# EAGLE design Bus Controller (EAGLE 5.06)
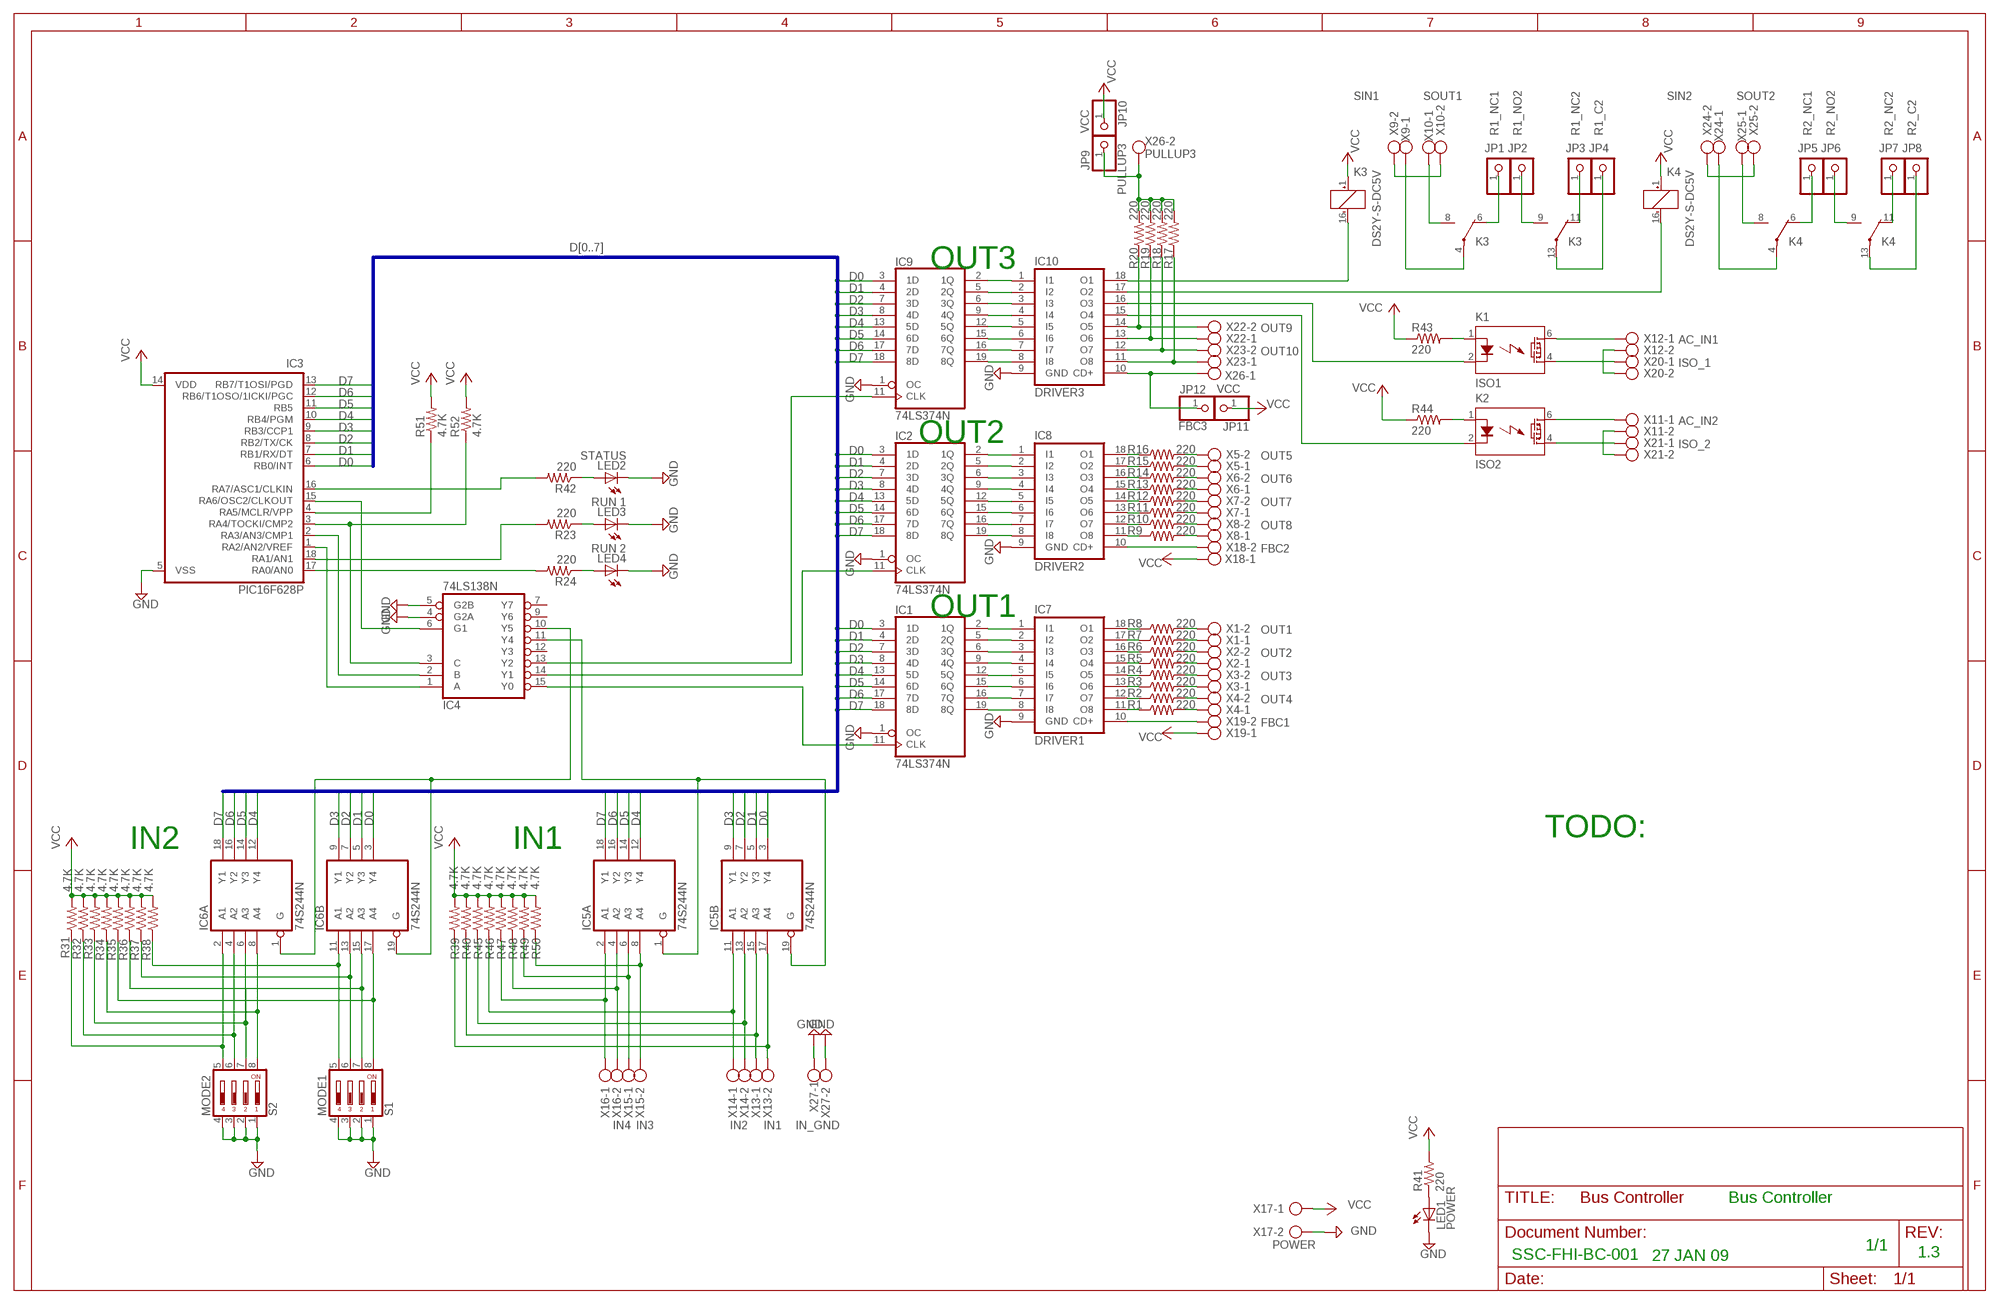
[diagram p0: schematic, sheet 1]

## Parts
IC1  74LS374N  [DIL20]
IC2  74LS374N  [DIL20]
IC3  PIC16F628P  [DIL18]
IC4  74LS138N  [DIL16]
IC5  74S244N  [DIL20]
IC6  74S244N  [DIL20]
IC7  DRIVER1  ULN2803A  [DIL18]
IC8  DRIVER2  ULN2803A  [DIL18]
IC9  74LS374N  [DIL20]
IC10  DRIVER3  ULN2803A  [DIL18]
JP1  R1_NC1  PINHD-1X1  [1X01]
JP2  R1_NO2  PINHD-1X1  [1X01]
JP3  R1_NC2  PINHD-1X1  [1X01]
JP4  R1_C2  PINHD-1X1  [1X01]
JP5  R2_NC1  PINHD-1X1  [1X01]
JP6  R2_NO2  PINHD-1X1  [1X01]
JP7  R2_NC2  PINHD-1X1  [1X01]
JP8  R2_C2  PINHD-1X1  [1X01]
JP9  PULLUP3  PINHD-1X1  [1X01]
JP10  VCC  PINHD-1X1  [1X01]
JP11  VCC  PINHD-1X1  [1X01]
JP12  FBC3  PINHD-1X1  [1X01]
K1  ISO1  LCA110  [DIL06]
K2  ISO2  LCA110  [DIL06]
K3  DS2Y-S-DC5V  [DS2Y]
K4  DS2Y-S-DC5V  [DS2Y]
LED1  POWER  LED5MM  [LED5MM]
LED2  STATUS  LED5MM  [LED5MM]
LED3  RUN 1  LED5MM  [LED5MM]
LED4  RUN 2  LED5MM  [LED5MM]
R1  220  R-US_0207/2V  [0207/2V]
R2  220  R-US_0207/2V  [0207/2V]
R3  220  R-US_0207/2V  [0207/2V]
R4  220  R-US_0207/2V  [0207/2V]
R5  220  R-US_0207/2V  [0207/2V]
R6  220  R-US_0207/2V  [0207/2V]
R7  220  R-US_0207/2V  [0207/2V]
R8  220  R-US_0207/2V  [0207/2V]
R9  220  R-US_0207/2V  [0207/2V]
R10  220  R-US_0207/2V  [0207/2V]
R11  220  R-US_0207/2V  [0207/2V]
R12  220  R-US_0207/2V  [0207/2V]
R13  220  R-US_0207/2V  [0207/2V]
R14  220  R-US_0207/2V  [0207/2V]
R15  220  R-US_0207/2V  [0207/2V]
R16  220  R-US_0207/2V  [0207/2V]
R17  220  R-US_0207/2V  [0207/2V]
R18  220  R-US_0207/2V  [0207/2V]
R19  220  R-US_0207/2V  [0207/2V]
R20  220  R-US_0207/2V  [0207/2V]
R23  220  R-US_0207/2V  [0207/2V]
R24  220  R-US_0207/2V  [0207/2V]
R31  4.7K  R-US_0207/2V  [0207/2V]
R32  4.7K  R-US_0207/2V  [0207/2V]
R33  4.7K  R-US_0207/2V  [0207/2V]
R34  4.7K  R-US_0207/2V  [0207/2V]
R35  4.7K  R-US_0207/2V  [0207/2V]
R36  4.7K  R-US_0207/2V  [0207/2V]
R37  4.7K  R-US_0207/2V  [0207/2V]
R38  4.7K  R-US_0207/2V  [0207/2V]
R39  4.7K  R-US_0207/2V  [0207/2V]
R40  4.7K  R-US_0207/2V  [0207/2V]
R41  220  R-US_0207/2V  [0207/2V]
R42  220  R-US_0207/2V  [0207/2V]
R43  220  R-US_0207/2V  [0207/2V]
R44  220  R-US_0207/2V  [0207/2V]
R45  4.7K  R-US_0207/2V  [0207/2V]
R46  4.7K  R-US_0207/2V  [0207/2V]
R47  4.7K  R-US_0207/2V  [0207/2V]
R48  4.7K  R-US_0207/2V  [0207/2V]
R49  4.7K  R-US_0207/2V  [0207/2V]
R50  4.7K  R-US_0207/2V  [0207/2V]
R51  4.7K  R-US_0207/2V  [0207/2V]
R52  4.7K  R-US_0207/2V  [0207/2V]
S1  MODE1  DS04  [DS-04]
S2  MODE2  DS04  [DS-04]
X1  OUT1  AK550/2  [AK550/2]
X2  OUT2  AK550/2  [AK550/2]
X3  OUT3  AK550/2  [AK550/2]
X4  OUT4  AK550/2  [AK550/2]
X5  OUT5  AK550/2  [AK550/2]
X6  OUT6  AK550/2  [AK550/2]
X7  OUT7  AK550/2  [AK550/2]
X8  OUT8  AK550/2  [AK550/2]
X9  SIN1  AK550/2  [AK550/2]
X10  SOUT1  AK550/2  [AK550/2]
X11  AC_IN2  AK550/2  [AK550/2]
X12  AC_IN1  AK550/2  [AK550/2]
X13  IN1  AK550/2  [AK550/2]
X14  IN2  AK550/2  [AK550/2]
X15  IN3  AK550/2  [AK550/2]
X16  IN4  AK550/2  [AK550/2]
X17  POWER  AK500/2  [AK500/2]
X18  FBC2  AK550/2  [AK550/2]
X19  FBC1  AK550/2  [AK550/2]
X20  ISO_1  AK550/2  [AK550/2]
X21  ISO_2  AK550/2  [AK550/2]
X22  OUT9  AK550/2  [AK550/2]
X23  OUT10  AK550/2  [AK550/2]
X24  SIN2  AK550/2  [AK550/2]
X25  SOUT2  AK550/2  [AK550/2]
X26  PULLUP3  AK550/2  [AK550/2]
X27  IN_GND  AK550/2  [AK550/2]

## Nets
A0: IC3.1(RA2/AN2/VREF) IC4.1(A)
A1: IC3.2(RA3/AN3/CMP1) IC4.2(B)
A2: IC3.3(RA4/TOCKI/CMP2) IC4.3(C) R52.1
ADDR_EN: IC3.15(RA6/OSC2/CLKOUT) IC4.6(G1)
D0: IC1.3(1D) IC2.3(1D) IC3.6(RB0/INT) IC5.3(B:Y4) IC6.3(B:Y4) IC9.3(1D)
D1: IC1.4(2D) IC2.4(2D) IC3.7(RB1/RX/DT) IC5.5(B:Y3) IC6.5(B:Y3) IC9.4(2D)
D2: IC1.7(3D) IC2.7(3D) IC3.8(RB2/TX/CK) IC5.7(B:Y2) IC6.7(B:Y2) IC9.7(3D)
D3: IC1.8(4D) IC2.8(4D) IC3.9(RB3/CCP1) IC5.9(B:Y1) IC6.9(B:Y1) IC9.8(4D)
D4: IC1.13(5D) IC2.13(5D) IC3.10(RB4/PGM) IC5.12(A:Y4) IC6.12(A:Y4) IC9.13(5D)
D5: IC1.14(6D) IC2.14(6D) IC3.11(RB5) IC5.14(A:Y3) IC6.14(A:Y3) IC9.14(6D)
D6: IC1.17(7D) IC2.17(7D) IC3.12(RB6/T1OSO/1ICKI/PGC) IC5.16(A:Y2) IC6.16(A:Y2) IC9.17(7D)
D7: IC1.18(8D) IC2.18(8D) IC3.13(RB7/T1OSI/PGD) IC5.18(A:Y1) IC6.18(A:Y1) IC9.18(8D)
FBC1: IC7.10(CD+) X19.2
FBC2: IC8.10(CD+) X18.2
FBC3: IC10.10(CD+) JP12.1 X26.1
GND: IC1.1(OC) IC2.1(OC) IC3.5(VSS) IC4.4(G2A) IC4.5(G2B) IC7.9(GND) IC8.9(GND) IC9.1(OC) IC10.9(GND) LED1.K(C) LED2.K(C) LED3.K(C) LED4.K(C) S1.1 S1.2 S1.3 S1.4 S2.1 S2.2 S2.3 S2.4 X17.2 X27.1 X27.2
IN1: IC5.17(B:A4) R39.1 X13.2
IN2: IC5.15(B:A3) R40.1 X13.1
IN3: IC5.13(B:A2) R45.1 X14.2
IN4: IC5.11(B:A1) R46.1 X14.1
IN5: IC5.8(A:A4) R50.1 X15.2
IN6: IC5.6(A:A3) R49.1 X15.1
IN7: IC5.4(A:A2) R48.1 X16.2
IN8: IC5.2(A:A1) R47.1 X16.1
IN9: IC6.17(B:A4) R35.1 S1.8
IN10: IC6.15(B:A3) R36.1 S1.7
IN11: IC6.13(B:A2) R37.1 S1.6
IN12: IC6.11(B:A1) R38.1 S1.5
IN13: IC6.8(A:A4) R34.1 S2.8
IN14: IC6.6(A:A3) R33.1 S2.7
IN15: IC6.4(A:A2) R32.1 S2.6
IN16: IC6.2(A:A1) R31.1 S2.5
ISO_IN1: K1.6(D1) X12.1
ISO_IN2: K2.6(D1) X11.1
ISO_OUT1: K1.4(D2) X20.1
ISO_OUT2: K2.4(D2) X21.1
ISOGND1: X12.2 X20.2
ISOGND2: X11.2 X21.2
N$2: IC3.4(RA5/MCLR/VPP) R51.1
N$3: IC4.13(Y2) IC9.11(CLK)
N$4: IC7.12(O7) R2.1
N$5: IC2.11(CLK) IC4.14(Y1)
N$6: IC1.11(CLK) IC4.15(Y0)
N$7: IC9.19(8Q) IC10.8(I8)
N$8: IC9.16(7Q) IC10.7(I7)
N$9: IC9.15(6Q) IC10.6(I6)
N$10: IC9.12(5Q) IC10.5(I5)
N$11: IC9.9(4Q) IC10.4(I4)
N$12: IC7.18(O1) R8.1
N$13: IC7.17(O2) R7.1
N$14: IC7.16(O3) R6.1
N$15: IC7.15(O4) R5.1
N$16: IC9.6(3Q) IC10.3(I3)
N$17: IC8.12(O7) R10.1
N$18: IC9.5(2Q) IC10.2(I2)
N$19: IC9.2(1Q) IC10.1(I1)
N$20: IC1.16(7Q) IC7.7(I7)
N$21: IC7.14(O5) R4.1
N$22: IC1.19(8Q) IC7.8(I8)
N$23: IC1.2(1Q) IC7.1(I1)
N$24: IC1.5(2Q) IC7.2(I2)
N$25: IC1.6(3Q) IC7.3(I3)
N$26: IC1.9(4Q) IC7.4(I4)
N$27: IC1.12(5Q) IC7.5(I5)
N$28: IC1.15(6Q) IC7.6(I6)
N$29: IC2.19(8Q) IC8.8(I8)
N$30: IC7.13(O6) R3.1
N$31: IC2.16(7Q) IC8.7(I7)
N$32: IC7.11(O8) R1.1
N$33: IC2.15(6Q) IC8.6(I6)
N$34: IC10.16(O3) K1.2(K)
N$35: IC10.15(O4) K2.2(K)
N$37: LED4.A R24.1
N$38: LED3.A R23.1
N$40: IC10.14(O5) R20.1 X22.2
N$41: IC10.13(O6) R19.1 X22.1
N$42: IC10.12(O7) R18.1 X23.2
N$43: IC10.11(O8) R17.1 X23.1
N$55: IC2.2(1Q) IC8.1(I1)
N$56: IC2.5(2Q) IC8.2(I2)
N$57: IC2.6(3Q) IC8.3(I3)
N$58: IC2.9(4Q) IC8.4(I4)
N$59: IC2.12(5Q) IC8.5(I5)
N$61: IC8.18(O1) R16.1
N$62: IC8.17(O2) R15.1
N$63: IC8.16(O3) R14.1
N$64: IC8.15(O4) R13.1
N$65: IC8.14(O5) R12.1
N$66: IC8.13(O6) R11.1
N$68: IC8.11(O8) R9.1
N$71: LED1.A R41.1
N$105: IC4.10(Y5) IC6.1(A:G) IC6.19(B:G)
N$106: LED2.A R42.1
N$107: K1.1(A) R43.2
N$108: K2.1(A) R44.2
N$109: IC4.11(Y4) IC5.1(A:G) IC5.19(B:G)
OUT1: R8.2 X1.2
OUT2: R7.2 X1.1
OUT3: R6.2 X2.2
OUT4: R5.2 X2.1
OUT5: R4.2 X3.2
OUT6: R3.2 X3.1
OUT7: R2.2 X4.2
OUT8: R1.2 X4.1
OUT9: R16.2 X5.2
OUT10: R15.2 X5.1
OUT11: R14.2 X6.2
OUT12: R13.2 X6.1
OUT13: R12.2 X7.2
OUT14: R11.2 X7.1
OUT15: R10.2 X8.2
OUT16: R9.2 X8.1
OUT17: IC10.18(O1) K3.16(1:-)
OUT18: IC10.17(O2) K4.16(1:-)
PULLUP3: JP9.1 R17.2 R18.2 R19.2 R20.2 X26.2
R1_C1: K3.4(2:P) X9.1
R1_C2: JP4.1 K3.13(3:P)
R1_GND: X9.2 X10.2
R1_NC1: JP1.1 K3.6(2:O)
R1_NC2: JP3.1 K3.11(3:O)
R1_NO1: K3.8(2:S) X10.1
R1_NO2: JP2.1 K3.9(3:S)
R2_C1: K4.4(2:P) X24.1
R2_C2: JP8.1 K4.13(3:P)
R2_GND: X24.2 X25.2
R2_NC1: JP5.1 K4.6(2:O)
R2_NC2: JP7.1 K4.11(3:O)
R2_NO1: K4.8(2:S) X25.1
R2_NO2: JP6.1 K4.9(3:S)
RUN1: IC3.18(RA1/AN1) R23.2
RUN2: IC3.17(RA0/AN0) R24.2
STATUS: IC3.16(RA7/ASC1/CLKIN) R42.2
VCC: IC3.14(VDD) JP10.1 JP11.1 K3.1(1:+) K4.1(1:+) R31.2 R32.2 R33.2 R34.2 R35.2 R36.2 R37.2 R38.2 R39.2 R40.2 R41.2 R43.1 R44.1 R45.2 R46.2 R47.2 R48.2 R49.2 R50.2 R51.2 R52.2 X17.1 X18.1 X19.1
Unconnected: IC4.7(Y7) IC4.9(Y6) IC4.12(Y3)

## Buses
D[0..7]

## Notes on the sheet
- OUT3
- OUT2
- OUT1
- TODO:
- IN2 | IN1
- Bus Controller
- 1/1
- SSC-FHI-BC-001 | 27 JAN 09 | 1.3

## Power pins joined to a net without a drawn wire
GND: IC1.10(GND) IC2.10(GND) IC4.8(GND) IC5.10(P:GND) IC6.10(P:GND) IC9.10(GND)
VCC: IC1.20(VCC) IC2.20(VCC) IC4.16(VCC) IC5.20(P:VCC) IC6.20(P:VCC) IC9.20(VCC)

## Library data of the parts
IC1 IC2 IC9 = 74xx-us:74*374: Octal D type transparent LATCH, edge triggered
IC3 = microchip:PIC16*F62: FLASH-Based 8-Bit CMOS Microcontroller Source: http://ww1.microchip.com/downloads/en/DeviceDoc/40300C.pdf
IC4 = 74xx-eu:74*138: 3-line to 8-line DECODER/DEMULTIPLEXER
IC5 IC6 = 74xx-us:74*244: Octal BUFFER and LINE DRIVER, 3-state
IC7 IC8 IC10 = uln-udn:ULN2803A: DRIVER ARRAY
JP1-JP12 = pinhead:PINHD-1X1: PIN HEADER
K1 K2 = relay:LCA110: Solid state relay. Clare LCA110
K3 K4 = relay:DS2Y-S-DC*: MINIATURE RELAY NAiS Source: http://www.mew-europe.com/.. en_ds_61005_0023.pdf
LED1-LED4 = led:LED: LED OSRAM: - CHIPLED LG R971, LG N971, LY N971, LG Q971, LY Q971, LO R971, LY R971 LH N974, LH R974 LS Q976, LO Q976, LY Q976 LO Q996 - Hyper CHIPLED LW Q18S LB Q993, LB Q99A, LB R99A - SideLED LS A670, LO A670, LY A670, LG A670, LP A670 LB A673, LV A673, LT A673, LW A673 LH A674 LY A675 LS A676, LA A676, LO A676, LY A676, LW A676 LS A679, LY A679, LG A679 - Hyper Micro SIDELED® LS Y876, LA Y876, LO Y876, LY Y876 LT Y87S - SmartLED LW L88C, LW L88S LB L89C, LB L89S, LG L890 LS L89K, LO L89K, LY L89K LS L896, LA L896, LO L896, LY L896 - TOPLED LS T670, LO T670, LY T670, LG T670, LP T670 LSG T670, LSP T670, LSY T670, LOP T670, LYG T670 LG T671, LOG T671, LSG T671 LB T673, LV T673, LT T673, LW T673 LH T674 LS T676, LA T676, LO T676, LY T676, LB T676, LH T676, LSB T676, LW T676 LB T67C, LV T67C, LT T67C, LS T67K, LO T67K, LY T67K, LW E67C LS E67B, LA E67B, LO E67B, LY E67B, LB E67C, LV E67C, LT E67C LW T67C LS T679, LY T679, LG T679 LS T770, LO T770, LY T770, LG T770, LP T770 LB T773, LV T773, LT T773, LW T773 LH T774 LS E675, LA E675, LY E675, LS T675 LS T776, LA T776, LO T776, LY T776, LB T776 LHGB T686 LT T68C, LB T68C - Hyper Mini TOPLED® LB M676 - Mini TOPLED Santana® LG M470 LS M47K, LO M47K, LY M47K Source: http://www.osram.convergy.de - LUMILED® LXK2-PW12-R00, LXK2-PW12-S00, LXK2-PW14-U00, LXK2-PW14-V00 LXK2-PM12-R00, LXK2-PM12-S00, LXK2-PM14-U00 LXK2-PE12-Q00, LXK2-PE12-R00, LXK2-PE12-S00, LXK2-PE14-T00, LXK2-PE14-U00 LXK2-PB12-K00, LXK2-PB12-L00, LXK2-PB12-M00, LXK2-PB14-N00, LXK2-PB14-P00, LXK2-PB14-Q00 LXK2-PR12-L00, LXK2-PR12-M00, LXK2-PR14-Q00, LXK2-PR14-R00 LXK2-PD12-Q00, LXK2-PD12-R00, LXK2-PD12-S00 LXK2-PH12-R00, LXK2-PH12-S00 LXK2-PL12-P00, LXK2-PL12-Q00, LXK2-PL12-R00 Source: www.luxeon.com
R1-R20 R23 R24 R31-R52 = resistor:R-US_: RESISTOR, American symbol
S1 S2 = switch-dil:DS04: DIL/CODE SWITCH
X1-X16 X18-X27 = con-ptr500+_v5:AK550/2: CONNECTOR
X17 = con-ptr500:AK500/2: CONNECTOR

## Board
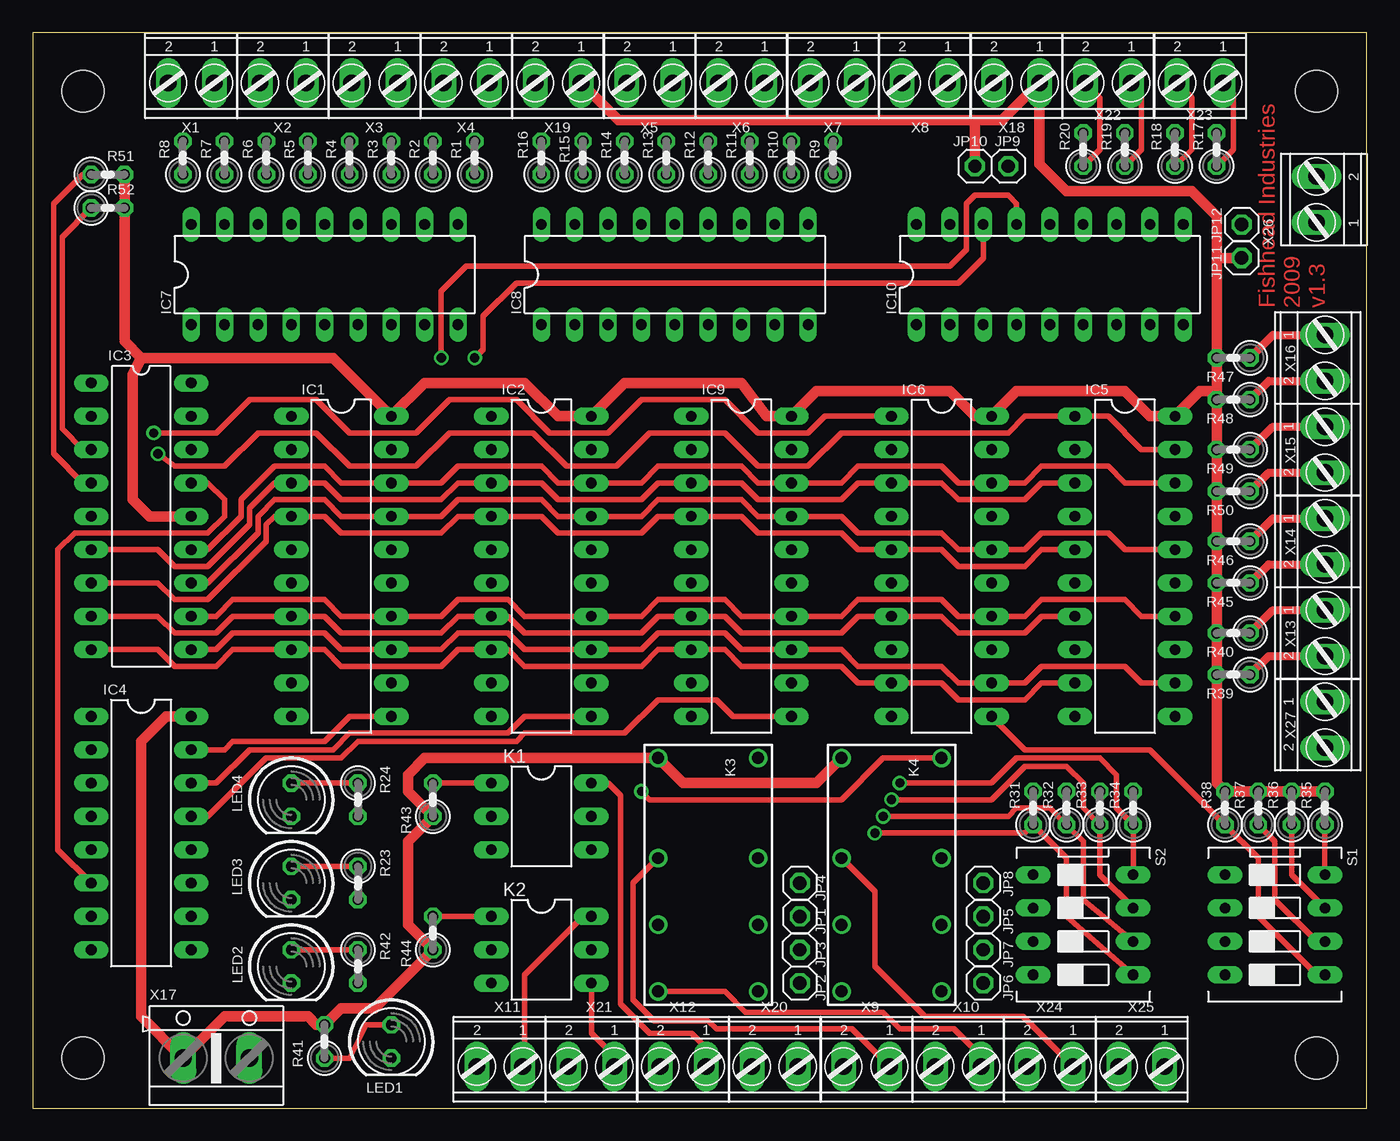
[diagram p1: board, top side]
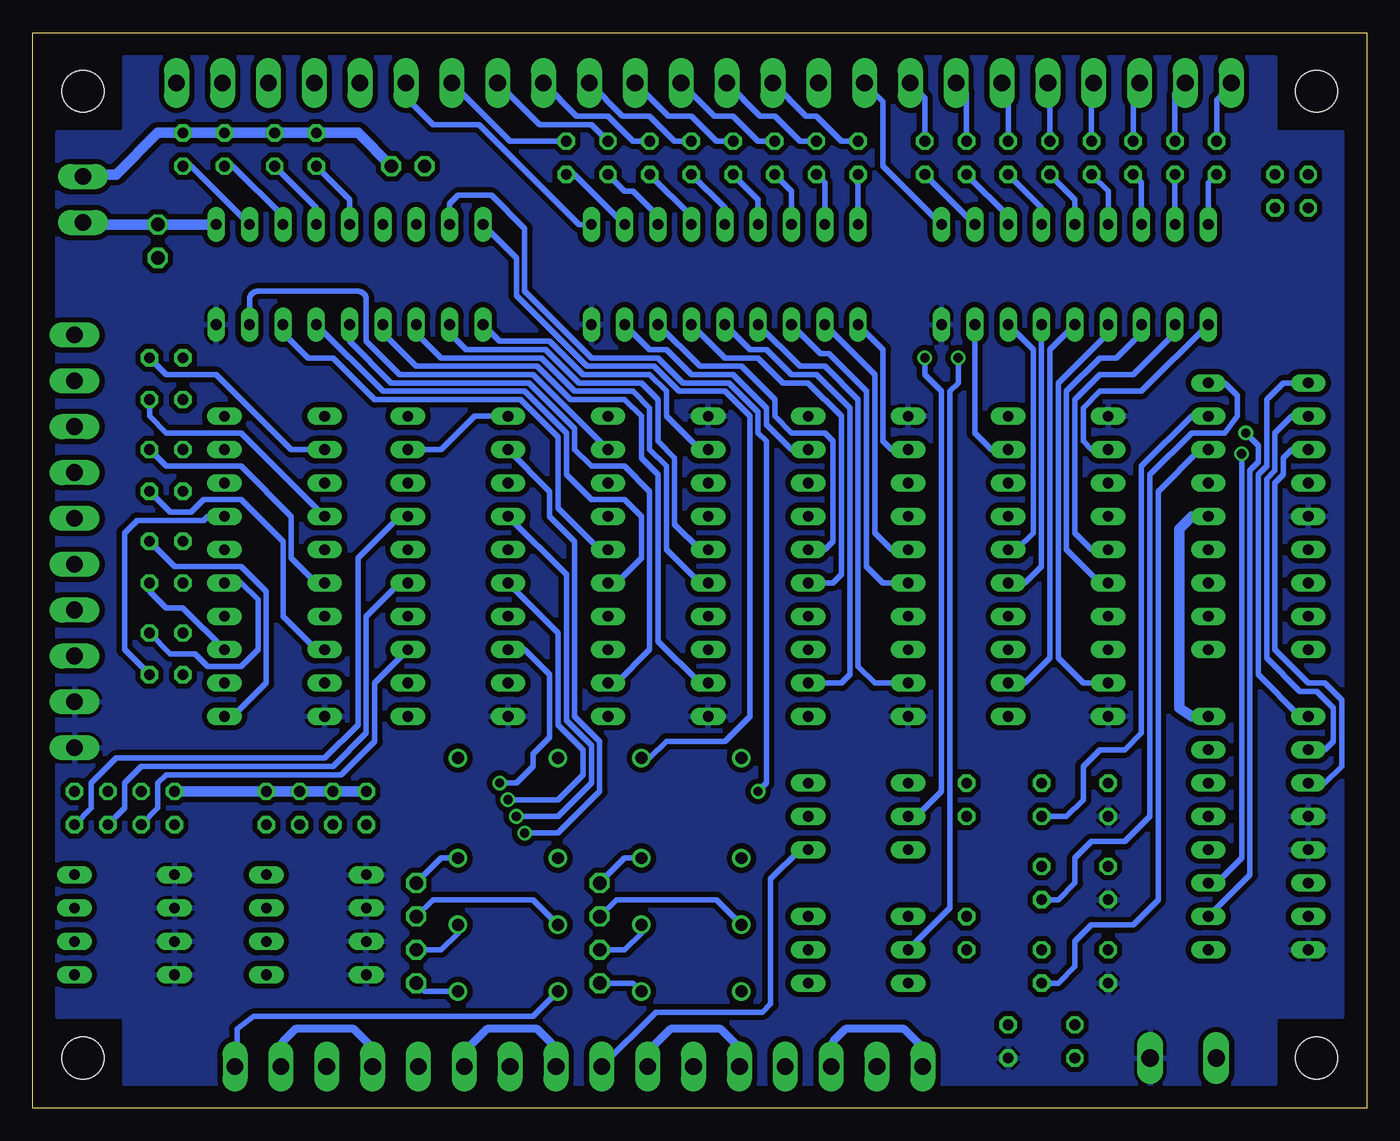
[diagram p2: board, bottom side, seen from below]

Size 101.6 x 81.92 mm. Coordinates in mm from the lower left corner, seen from the top.
Outline: 0,0 101.6,0 101.6,81.92 0,81.92 0,0
Copper layers (1*16): Top 0.035mm / dielectric 1.5mm / Bottom 0.035mm
Design rules "default *": minimum track width 10mil, minimum drill 24mil, track to track 16mil, track to pad 16mil, pad to pad 16mil, via to via 8mil, smd to smd 8mil, copper to edge 40mil, drill to drill 8mil, minimum pad ring 10mil, minimum via ring 8mil, stop-mask expansion 4mil, vias tented up to drill 0mil, thermal gap 10mil
Holes 3.2 mm at 3.81,3.81 97.79,3.81 97.79,77.47 3.81,77.47

### Footprints (pad centres in the part's own frame; a part is rotated, then mirrored left to right if it is on the bottom)
DIL20 = drill 0.813 long: 1 -11.43,-3.81; 2 -8.89,-3.81; 3 -6.35,-3.81; 4 -3.81,-3.81; 5 -1.27,-3.81; 6 1.27,-3.81; 7 3.81,-3.81; 8 6.35,-3.81; 9 8.89,-3.81; 10 11.43,-3.81; 11 11.43,3.81; 12 8.89,3.81; 13 6.35,3.81; 14 3.81,3.81; 15 1.27,3.81; 16 -1.27,3.81; 17 -3.81,3.81; 18 -6.35,3.81; 19 -8.89,3.81; 20 -11.43,3.81
DIL18 = drill 0.813 long: 1 -10.16,-3.81; 2 -7.62,-3.81; 3 -5.08,-3.81; 4 -2.54,-3.81; 5 0,-3.81; 6 2.54,-3.81; 7 5.08,-3.81; 8 7.62,-3.81; 9 10.16,-3.81; 10 10.16,3.81; 11 7.62,3.81; 12 5.08,3.81; 13 2.54,3.81; 14 0,3.81; 15 -2.54,3.81; 16 -5.08,3.81; 17 -7.62,3.81; 18 -10.16,3.81
DIL16 = drill 0.813 long: 1 -8.89,-3.81; 2 -6.35,-3.81; 3 -3.81,-3.81; 4 -1.27,-3.81; 5 1.27,-3.81; 6 3.81,-3.81; 7 6.35,-3.81; 8 8.89,-3.81; 9 8.89,3.81; 10 6.35,3.81; 11 3.81,3.81; 12 1.27,3.81; 13 -1.27,3.81; 14 -3.81,3.81; 15 -6.35,3.81; 16 -8.89,3.81
1X01 = drill 1.016 octagon: 1 0,0
DIL06 = drill 0.813 long: 1 -2.54,-3.81; 2 0,-3.81; 3 2.54,-3.81; 4 2.54,3.81; 5 0,3.81; 6 -2.54,3.81
DS2Y = drill 0.9 round: 1 -8.89,-3.81; 4 -1.27,-3.81; 6 3.81,-3.81; 8 8.89,-3.81; 9 8.89,3.81; 11 3.81,3.81; 13 -1.27,3.81; 16 -8.89,3.81
LED5MM = drill 0.813 octagon: A -1.27,0; K 1.27,0
0207/2V = drill 0.813 octagon: 1 -1.27,0; 2 1.27,0
DS-04 = drill 0.813 long: 1 -3.81,-3.81; 2 -1.27,-3.81; 3 1.27,-3.81; 4 3.81,-3.81; 5 3.81,3.81; 6 1.27,3.81; 7 -1.27,3.81; 8 -3.81,3.81
AK550/2 = drill 1.27 long: 1 -1.75,0; 2 1.75,0
AK500/2 = drill 1.321 long: 1 -2.515,0; 2 2.515,0

### Placement (x,y rotation side)
IC1  23.5,41.27 270 top
IC2  38.73,41.27 270 top
IC3  8.26,45.09 270 top
IC4  8.26,20.95 270 top
IC5  83.19,41.27 270 top
IC6  69.22,41.27 270 top
IC7  22.23,63.5 0 top
IC8  48.9,63.5 0 top
IC9  53.98,41.27 270 top
IC10  77.47,63.5 0 top
JP1  58.42,14.61 0 top
JP2  58.42,9.53 0 top
JP3  58.42,12.06 90 top
JP4  58.42,17.14 0 top
JP5  72.39,14.61 0 top
JP6  72.39,9.53 0 top
JP7  72.39,12.06 0 top
JP8  72.39,17.14 0 top
JP9  74.3,71.75 0 top
JP10  71.75,71.75 0 top
JP11  92.08,64.77 0 top
JP12  92.08,67.31 0 top
K1  38.73,22.23 270 top
K2  38.73,12.06 270 top
K3  51.44,17.78 270 top
K4  65.41,17.78 270 top
LED1  27.3,5.08 270 top
LED2  19.68,10.79 270 top
LED3  19.68,17.14 270 top
LED4  19.68,23.5 270 top
R1  33.66,72.39 90 top
R2  30.48,72.39 90 top
R3  27.3,72.39 90 top
R4  24.13,72.39 90 top
R5  20.95,72.39 90 top
R6  17.78,72.39 90 top
R7  14.61,72.39 90 top
R8  11.43,72.39 90 top
R9  60.96,72.39 90 top
R10  57.78,72.39 90 top
R11  54.61,72.39 90 top
R12  51.44,72.39 90 top
R13  48.26,72.39 90 top
R14  45.09,72.39 90 top
R15  41.91,72.39 90 top
R16  38.73,72.39 90 top
R17  90.17,73.03 90 top
R18  87,73.03 90 top
R19  83.19,73.03 90 top
R20  80.01,73.03 90 top
R23  24.77,17.14 270 top
R24  24.77,23.5 270 top
R31  76.2,22.86 90 top
R32  78.74,22.86 90 top
R33  81.28,22.86 90 top
R34  83.82,22.86 90 top
R35  98.42,22.86 90 top
R36  95.89,22.86 90 top
R37  93.34,22.86 90 top
R38  90.81,22.86 90 top
R39  91.44,33.02 180 top
R40  91.44,36.2 180 top
R41  22.23,5.08 90 top
R42  24.77,10.79 270 top
R43  30.48,23.5 90 top
R44  30.48,13.34 90 top
R45  91.44,40.01 180 top
R46  91.44,43.18 180 top
R47  91.44,57.15 180 top
R48  91.44,53.98 180 top
R49  91.44,50.16 180 top
R50  91.44,46.99 180 top
R51  5.71,71.12 0 top
R52  5.71,68.58 0 top
S1  94.61,13.97 270 top
S2  80.01,13.97 270 top
X1  12.06,78.11 180 top
X2  19.05,78.11 180 top
X3  26.04,78.11 180 top
X4  33.02,78.11 180 top
X5  46.99,78.11 180 top
X6  53.98,78.11 180 top
X7  60.96,78.11 180 top
X8  67.94,78.11 180 top
X9  63.5,3.17 180 top
X10  70.48,3.17 180 top
X11  35.56,3.17 180 top
X12  49.53,3.17 180 top
X13  98.42,36.2 270 top
X14  98.42,43.18 270 top
X15  98.42,50.16 270 top
X16  98.42,57.15 270 top
X17  13.97,3.81 0 top
X18  74.93,78.11 180 top
X19  40.01,78.11 180 top
X20  56.52,3.17 180 top
X21  42.55,3.17 180 top
X22  81.92,78.11 180 top
X23  88.9,78.11 180 top
X24  77.47,3.17 180 top
X25  84.45,3.17 180 top
X26  97.79,69.22 90 top
X27  98.42,29.21 270 top

### Tracks (layer width: path | path; a pad name or v marks a point on that pad's centre or on a via)
A0
  Bottom 0.406: IC4.1 5.08,29.84 8.26,33.02 8.26,48.26 7.62,48.9 7.62,53.98 6.35,55.24 IC3.1
A1
  Bottom 0.406: IC4.2 3.17,27.3 2.54,27.94 2.54,30.48 3.81,31.75 5.08,31.75 7.62,34.29 7.62,47.94 6.99,48.58 6.99,51.44 5.71,52.7 IC3.2
A2
  Top 0.406: IC3.3 3.81,50.16 2.22,51.75 2.22,66.36 R52.1
  Bottom 0.406: IC4.3 3.17,24.77 1.91,26.04 1.91,31.11 3.17,32.38 4.45,32.38 6.99,34.92 6.99,47.62 6.35,48.26 6.35,49.53 5.71,50.16 IC3.3
ADDR_EN
  Top 0.406: IC4.6 1.91,19.68 1.91,42.55 3.17,43.81 13.34,43.81 14.61,45.09 14.61,46.35 13.34,47.62 IC3.15
D0
  Top 0.406: IC5.3 76.83,47.62 75.56,46.35 70.48,46.35 69.22,47.62 IC6.3 62.87,47.62 61.59,46.35 55.24,46.35 53.98,47.62 IC9.3 47.62,47.62 46.35,46.35 40.01,46.35 38.73,47.62 IC2.3 32.38,47.62 31.11,46.35 23.5,46.35 22.23,47.62 IC1.3 18.41,47.62 16.51,45.72 16.51,44.45 13.34,41.27 10.79,41.27 9.53,42.55 IC3.6
D1
  Top 0.406: IC5.5 76.83,42.55 75.56,41.27 70.48,41.27 69.22,42.55 IC6.5 62.87,42.55 61.59,43.81 55.24,43.81 53.98,45.09 IC9.4 47.62,45.09 46.35,43.81 40.01,43.81 38.73,45.09 IC2.4 32.38,45.09 31.11,43.81 23.5,43.81 22.23,45.09 IC1.4 18.41,45.09 17.78,44.45 17.78,43.18 13.34,38.73 10.79,38.73 9.53,40.01 IC3.7
D2
  Top 0.406: IC5.7 76.83,37.47 75.56,36.2 70.48,36.2 69.22,37.47 IC6.7 62.87,37.47 61.59,36.2 53.98,36.2 52.7,37.47 IC9.7 47.62,37.47 46.35,36.2 37.47,36.2 36.2,37.47 IC2.7 32.38,37.47 31.11,36.2 23.5,36.2 22.23,37.47 IC1.7 15.24,37.47 13.97,36.2 10.79,36.2 9.53,37.47 IC3.8
D3
  Top 0.406: IC5.9 76.83,32.38 75.56,31.11 70.48,31.11 69.22,32.38 IC6.9 62.87,32.38 61.59,33.66 53.98,33.66 52.7,34.92 IC9.8 47.62,34.92 46.35,33.66 37.47,33.66 36.2,34.92 IC2.8 32.38,34.92 31.11,33.66 23.5,33.66 22.23,34.92 IC1.8 15.24,34.92 13.97,33.66 10.79,33.66 9.53,34.92 IC3.9
D4
  Top 0.406: IC5.12 84.45,32.38 83.19,33.66 76.83,33.66 75.56,32.38 IC6.12 70.48,32.38 69.22,33.66 62.87,33.66 61.59,34.92 IC9.13 53.98,34.92 52.7,36.2 47.62,36.2 46.35,34.92 IC2.13 37.47,34.92 36.2,36.2 32.38,36.2 31.11,34.92 IC1.13 23.5,34.92 22.23,36.2 15.24,36.2 13.97,34.92 IC3.10
D5
  Top 0.406: 75.56,37.47 IC6.14 | 75.56,37.47 76.83,38.73 83.19,38.73 84.45,37.47 IC5.14 | 75.56,37.47 70.48,37.47 69.22,38.73 62.87,38.73 61.59,37.47 IC9.14 53.98,37.47 52.7,38.73 47.62,38.73 46.35,37.47 IC2.14 37.47,37.47 36.2,38.73 32.38,38.73 31.11,37.47 IC1.14 23.5,37.47 22.23,38.73 15.24,38.73 13.97,37.47 IC3.11
D6
  Top 0.406: IC5.16 83.19,42.55 81.92,43.81 76.83,43.81 75.56,42.55 IC6.16 70.48,42.55 69.22,43.81 62.87,43.81 61.59,45.09 IC9.17 55.24,45.09 53.98,46.35 47.62,46.35 46.35,45.09 IC2.17 40.01,45.09 38.73,46.35 32.38,46.35 31.11,45.09 IC1.17 23.5,45.09 22.23,46.35 18.41,46.35 17.14,45.09 17.14,43.81 13.34,40.01 IC3.12
D7
  Top 0.406: IC5.18 83.19,47.62 81.92,48.9 76.83,48.9 75.56,47.62 IC6.18 70.48,47.62 69.22,48.9 62.87,48.9 61.59,47.62 IC9.18 55.24,47.62 53.98,48.9 47.62,48.9 46.35,47.62 IC2.18 40.01,47.62 38.73,48.9 32.38,48.9 31.11,47.62 IC1.18 23.5,47.62 22.23,48.9 18.41,48.9 15.88,46.35 15.88,45.09 13.34,42.55 IC3.13
FBC1
  Bottom 0.406: IC7.10 36.83,71.75 36.83,76.68 X19.2
FBC2
  Bottom 0.406: X18.2 73.18,76.99 71.12,74.93 67.63,74.93 60.01,67.31 IC8.10
FBC3
  Bottom 0.813: IC10.10 JP12.1 97.64,67.31 X26.1
GND
  pour Bottom: 1.91,74.3 6.99,74.3 6.99,80.01 94.61,80.01 94.61,74.93 94.61,74.3 99.69,74.3 99.69,37.47 99.69,6.99 94.61,6.99 94.61,1.91 6.99,1.91 6.99,6.99 1.91,6.99
IN1
  Top 0.61: X13.2 94.14,34.45 R39.1
  Bottom 0.406: IC5.17 88.27,45.09 88.58,44.77 93.66,44.77 94.61,43.81 94.61,34.92 R39.1
IN2
  Top 0.61: X13.1 94.46,37.95 R40.1
  Bottom 0.406: IC5.15 85.72,40.01 84.45,38.73 84.45,34.92 85.72,33.66 88.27,33.66 89.22,34.61 91.12,34.61 R40.1
IN3
  Top 0.61: X14.2 94.14,41.43 R45.1
  Bottom 0.406: IC5.13 90.17,38.1 91.44,38.1 92.71,39.37 R45.1
IN4
  Top 0.61: X14.1 94.46,44.93 R46.1
  Bottom 0.406: IC5.11 86.36,29.84 83.82,32.38 83.82,39.37 85.72,41.27 90.81,41.27 R46.1
IN5
  Top 0.61: X15.2 94.14,48.41 R50.1
  Bottom 0.406: IC5.8 80.01,34.92 82.55,37.47 82.55,43.18 85.72,46.35 88.58,46.35 89.53,45.4 91.12,45.4 R50.1
IN6
  Top 0.61: X15.1 94.46,51.91 R49.1
  Bottom 0.406: IC5.6 80.01,40.01 81.92,41.91 81.92,45.09 85.72,48.9 91.44,48.9 R49.1
IN7
  Top 0.61: X16.2 94.14,55.4 R48.1
  Bottom 0.406: IC5.4 85.72,51.44 91.44,51.44 92.71,52.7 R48.1
IN8
  Top 0.61: X16.1 94.46,58.9 R47.1
  Bottom 0.406: IC5.2 81.92,50.16 87.63,55.88 91.44,55.88 R47.1
IN9
  Top 0.406: R35.1 S1.8
  Bottom 0.406: IC6.17 73.66,45.09 76.83,41.91 76.83,29.21 79.38,26.67 95.25,26.67 97.16,24.77 97.16,22.86 R35.1
IN10
  Top 0.406: S1.7 95.89,17.78 R36.1
  Bottom 0.406: IC6.15 73.66,40.01 76.2,37.47 76.2,28.57 78.74,26.04 93.34,26.04 94.61,24.77 94.61,22.86 R36.1
IN11
  Top 0.406: S1.6 97.79,12.7 94.61,15.88 94.61,20.32 R37.1
  Bottom 0.406: IC6.13 75.56,32.38 75.56,27.94 78.11,25.4 91.44,25.4 92.08,24.77 92.08,22.86 R37.1
IN12
  Top 0.406: S1.5 97.79,10.16 93.34,14.61 93.34,19.05 R38.1 85.09,27.3 75.56,27.3 IC6.11
IN13  (via drill 0.7)
  Top 0.406: S2.8 R34.1 82.55,22.86 82.55,25.4 81.28,26.67 74.93,26.67 73.03,24.77 v66.04,24.77
  Bottom 0.406: IC6.8 64.14,34.92 62.23,33.02 62.23,28.26 63.5,26.99 63.5,26.04 64.77,24.77 v66.04,24.77
IN14  (via drill 0.7)
  Top 0.406: S2.7 81.28,17.78 R33.1 80.01,22.86 80.01,24.77 78.74,26.04 75.56,26.04 73.03,23.5 v65.41,23.5
  Bottom 0.406: IC6.6 61.59,36.2 61.59,29.21 59.69,27.3 59.69,25.4 61.59,23.5 v65.41,23.5
IN15  (via drill 0.7)
  Top 0.406: S2.6 80.01,15.88 80.01,20.32 R32.1 77.47,22.86 74.93,22.86 74.3,22.23 v64.77,22.23
  Bottom 0.406: IC6.4 60.96,40.64 60.96,29.53 59.05,27.62 59.05,24.77 61.59,22.23 v64.77,22.23
IN16  (via drill 0.7)
  Top 0.406: S2.5 78.74,14.61 78.74,19.05 R31.1 75.56,20.95 v64.14,20.95
  Bottom 0.406: IC6.2 62.23,46.99 62.23,45.09 60.33,43.18 60.33,29.84 58.42,27.94 58.42,24.13 61.59,20.95 v64.14,20.95
ISO_IN1
  Top 0.406: K1.6 43.81,24.77 44.77,23.81 44.77,7.94 46.99,5.71 50.16,5.71 51.44,4.45 | 51.28,4.29 X12.1
  Top 0.61: 51.44,4.45 51.28,4.29
ISO_IN2
  Top 0.406: K2.6 41.91,14.61 37.47,10.16 37.47,3.17 X11.1
ISO_OUT1
  Bottom 0.406: X20.1 54.14,7.3 46.04,7.3 45.4,7.94 45.4,17.46 43.18,19.68 K1.4
ISO_OUT2
  Top 0.406: K2.4 42.55,5.71 44.3,3.96 X21.1
ISOGND1
  Bottom 0.61: X12.2 47.78,4.6 49.21,6.03 53.02,6.03 54.61,4.45 54.61,3.33 X20.2
ISOGND2
  Bottom 0.61: X11.2 33.81,4.6 35.24,6.03 39.69,6.03 40.64,5.08 40.64,3.33 X21.2
N$2
  Top 0.406: IC3.4 3.81,47.62 1.59,49.85 1.59,68.9 3.81,71.12 R51.1
N$3
  Top 0.406: IC4.13 13.34,22.23 17.78,26.67 23.5,26.67 24.77,27.94 36.83,27.94 37.47,28.57 45.09,28.57 47.62,31.11 52.07,31.11 53.34,29.84 IC9.11
N$4
  Bottom 0.406: IC7.12 27.3,67.94 R2.1
N$5
  Top 0.406: IC4.14 13.97,24.77 16.51,27.3 22.86,27.3 24.13,28.57 36.2,28.57 37.47,29.84 IC2.11
N$6
  Top 0.406: IC4.15 14.61,27.3 15.24,27.94 22.23,27.94 24.13,29.84 IC1.11
N$7
  Bottom 0.406: IC10.8 85.09,61.59 arc90 84.45,62.23 76.83,62.23 arc90 76.2,61.59 76.2,58.42 73.66,55.88 63.5,55.88 IC9.19
N$8
  Bottom 0.406: IC9.16 58.42,42.55 61.59,45.72 61.59,51.12 64.45,53.98 75.56,53.98 78.74,57.15 80.64,57.15 82.55,59.05 IC10.7
N$9
  Bottom 0.406: IC9.15 57.15,40.01 55.24,41.91 55.24,45.09 56.52,46.35 59.05,46.35 60.96,48.26 60.96,51.44 64.14,54.61 74.93,54.61 IC10.6
N$10
  Bottom 0.406: IC10.5 77.47,58.42 74.3,55.24 63.82,55.24 60.33,51.75 60.33,50.16 59.05,48.9 56.52,48.9 54.61,46.99 54.61,34.92 57.15,32.38 IC9.12
N$11
  Bottom 0.406: IC9.9 50.8,32.38 53.98,35.56 53.98,48.26 55.24,49.53 55.24,52.7 56.52,53.98 60.64,53.98 63.18,56.52 72.39,56.52 74.93,59.05 IC10.4
N$12
  Bottom 0.406: IC7.18 12.06,70.48 R8.1
N$13
  Bottom 0.406: IC7.17 R7.1
N$14
  Bottom 0.406: IC7.16 17.14,70.48 R6.1
N$15
  Bottom 0.406: IC7.15 19.68,69.85 R5.1
N$16
  Bottom 0.406: IC9.6 50.8,40.01 53.34,42.55 53.34,48.9 54.61,50.16 54.61,53.34 55.88,54.61 60.33,54.61 62.87,57.15 70.48,57.15 72.39,59.05 IC10.3
N$17
  Bottom 0.406: IC8.12 53.98,67.94 55.88,69.85 56.52,69.85 R10.1
N$18
  Bottom 0.406: IC10.2 69.85,59.05 68.58,57.78 62.55,57.78 60.01,55.24 55.24,55.24 53.98,53.98 53.98,50.8 52.7,49.53 52.7,44.45 50.8,42.55 IC9.5
N$19
  Bottom 0.406: IC10.1 66.04,58.42 62.23,58.42 59.69,55.88 54.61,55.88 53.34,54.61 53.34,52.7 50.8,50.16 IC9.2
N$20
  Bottom 0.406: IC1.16 26.67,42.55 25.4,43.81 25.4,57.78 IC7.7
N$21
  Bottom 0.406: IC7.14 22.23,69.22 R4.1
N$22
  Bottom 0.406: IC1.19 28.57,50.16 29.84,51.44 IC7.8
N$23
  Bottom 0.406: IC1.2 20.95,50.16 21.59,50.8 21.59,53.34 20.32,54.61 17.14,54.61 IC7.1
N$24
  Bottom 0.406: IC1.5 20.95,42.55 22.23,43.81 22.23,53.98 20.32,55.88 17.78,55.88 14.61,59.05 IC7.2
N$25
  Bottom 0.406: IC1.6 20.32,40.01 22.86,42.55 22.86,54.61 20.32,57.15 19.05,57.15 17.14,59.05 IC7.3
N$26
  Bottom 0.406: IC1.9 21.59,32.38 23.5,34.29 23.5,55.24 19.68,59.05 IC7.4
N$27
  Bottom 0.406: IC1.12 26.04,32.38 24.13,34.29 24.13,57.78 IC7.5
N$28
  Bottom 0.406: IC1.15 26.04,40.01 24.77,41.27 IC7.6
N$29
  Bottom 0.406: IC2.19 43.81,50.16 45.72,52.07 45.72,53.34 48.26,55.88 51.44,55.88 53.34,57.78 54.61,57.78 IC8.8
N$30
  Bottom 0.406: IC7.13 24.77,68.58 R3.1
N$31
  Bottom 0.406: IC2.16 41.27,42.55 40.64,43.18 40.64,50.8 41.27,51.44 43.81,51.44 45.09,52.7 45.09,53.98 47.62,56.52 50.8,56.52 IC8.7
N$32
  Bottom 0.406: IC7.11 R1.1
N$33
  Bottom 0.406: IC2.15 40.64,40.01 40.01,40.64 40.01,52.7 42.55,55.24 44.45,55.24 46.35,57.15 48.9,57.15 IC8.6
N$34  (via drill 0.7)
  Top 0.406: IC10.16 72.39,64.77 70.48,62.87 36.83,62.87 34.29,60.33 34.29,57.78 v33.66,57.15
  Bottom 0.406: v33.66,57.15 33.66,55.88 32.38,54.61 32.38,24.13 34.29,22.23 K1.2
N$35  (via drill 0.7)
  Top 0.406: IC10.15 74.93,68.9 74.3,69.53 71.75,69.53 71.12,68.9 71.12,65.41 69.85,64.14 33.02,64.14 31.11,62.23 v31.11,57.15
  Bottom 0.406: K2.2 31.75,15.24 31.75,54.61 31.11,55.24 v31.11,57.15
N$37
  Top 0.406: LED4.A R24.1
N$38
  Top 0.406: LED3.A R23.1
N$40
  Top 0.406: R20.1 81.28,73.03 81.28,76.99 X22.2
  Bottom 0.406: R20.1 77.47,69.22 IC10.14
N$41
  Top 0.406: R19.1 84.45,73.03 84.45,77.31 X22.1
  Bottom 0.406: R19.1 80.01,68.58 IC10.13
N$42
  Top 0.406: R18.1 88.27,73.03 88.27,76.99 X23.2
  Bottom 0.406: R18.1 86.36,71.75 82.55,67.94 IC10.12
N$43
  Top 0.406: R17.1 91.44,73.03 91.44,77.31 X23.1
  Bottom 0.406: R17.1 89.53,71.75 IC10.11
N$55
  Bottom 0.406: IC2.2 36.2,50.16 36.83,50.8 36.83,57.78 IC8.1
N$56
  Bottom 0.406: IC2.5 36.2,42.55 37.47,43.81 37.47,55.88 IC8.2
N$57
  Bottom 0.406: IC2.6 36.83,40.01 38.1,41.27 38.1,54.61 40.96,57.47 41.59,57.47 IC8.3
N$58
  Bottom 0.406: IC2.9 37.47,32.38 38.73,33.66 38.73,53.98 41.27,56.52 43.18,56.52 IC8.4
N$59
  Bottom 0.406: IC2.12 40.01,32.38 39.37,33.02 39.37,53.34 41.91,55.88 43.81,55.88 45.72,57.78 46.99,57.78 IC8.5
N$61
  Bottom 0.406: IC8.18 R16.1
N$62
  Bottom 0.406: IC8.17 41.27,70.48 R15.1
N$63
  Bottom 0.406: IC8.16 43.81,69.85 R14.1
N$64
  Bottom 0.406: IC8.15 46.35,69.22 R13.1
N$65
  Bottom 0.406: IC8.14 48.9,68.58 R12.1
N$66
  Bottom 0.406: IC8.13 51.44,67.94 R11.1
N$68
  Bottom 0.406: IC8.11 60.33,71.12 R9.1
N$71
  Top 0.406: LED1.A 25.4,6.35 24.13,3.81 R41.1
N$105  (via drill 0.7)
  Top 0.406: IC6.1 60.33,52.7 59.05,51.44 55.24,51.44 52.7,53.98 46.35,53.98 43.81,51.44 39.37,51.44 36.83,53.98 31.75,53.98 29.21,51.44 24.13,51.44 21.59,53.98 16.51,53.98 13.97,51.44 v9.21,51.44
  Bottom 0.406: IC6.19 70.48,50.16 67.94,52.7 IC6.1 | IC4.10 8.89,17.78 8.89,48.58 8.26,49.21 8.26,50.48 v9.21,51.44
N$106
  Top 0.406: LED2.A R42.1
N$107
  Top 0.406: R43.2 K1.1
N$108
  Top 0.406: R44.2 K2.1
N$109  (via drill 0.7)
  Top 0.406: IC5.19 84.45,50.16 81.92,52.7 IC5.1 75.56,52.7 74.3,51.44 61.59,51.44 59.05,48.9 55.24,48.9 52.7,51.44 46.99,51.44 44.45,48.9 40.64,48.9 38.1,51.44 31.75,51.44 29.21,48.9 24.13,48.9 21.59,51.44 17.14,51.44 14.61,48.9 10.79,48.9 v9.53,49.85
  Bottom 0.406: IC4.11 11.43,17.14 9.53,19.05 v9.53,49.85
OUT1
  Bottom 0.406: R8.2 11.43,76.83 10.16,78.11 10.16,77.95 X1.2
OUT2
  Bottom 0.406: R7.2 14.61,77.31 X1.1
OUT3
  Bottom 0.406: R6.2 17.78,77.62 X2.2
OUT4
  Bottom 0.406: R5.2 20.95,77.95 X2.1
OUT5
  Bottom 0.406: R4.2 24.13,77.95 X3.2
OUT6
  Bottom 0.406: R3.2 27.3,77.62 X3.1
OUT7
  Bottom 0.406: R2.2 30.48,77.31 X4.2
OUT8
  Bottom 0.406: R1.2 33.66,76.99 X4.1
OUT9
  Bottom 0.406: R16.2 40.01,73.66 41.91,75.56 42.7,75.56 X5.2
OUT10
  Bottom 0.406: R15.2 43.18,73.66 45.09,75.56 46.2,75.56 X5.1
OUT11
  Bottom 0.406: R14.2 46.35,73.66 48.26,75.56 49.69,75.56 X6.2
OUT12
  Bottom 0.406: R13.2 49.53,73.66 51.44,75.56 53.19,75.56 X6.1
OUT13
  Bottom 0.406: R12.2 52.7,73.66 54.61,75.56 56.67,75.56 X7.2
OUT14
  Bottom 0.406: R11.2 55.88,73.66 57.78,75.56 60.17,75.56 X7.1
OUT15
  Bottom 0.406: R10.2 59.05,74.93 63.02,74.93 X8.2
OUT16
  Bottom 0.406: R9.2 65.25,73.66 X8.1
OUT17
  Bottom 0.406: IC10.18 64.77,64.77 64.77,61.91 59.37,56.52 54.29,56.52 52.39,54.61 48.9,54.61 46.99,52.7 46.99,29.84 48.9,27.94 53.34,27.94 54.61,26.67 K3.16
OUT18  (via drill 0.7)
  Top 0.406: v46.35,24.13 46.99,23.5 61.59,23.5 64.77,26.67 K4.16
  Bottom 0.406: IC10.17 69.85,68.9 69.22,69.53 66.67,69.53 64.14,66.99 64.14,62.23 59.05,57.15 53.98,57.15 52.07,55.24 48.58,55.24 46.35,53.02 46.35,51.44 45.72,50.8 45.72,24.77 v46.35,24.13
PULLUP3
  Bottom 0.813: X26.2 97.64,71.12 95.25,71.12 92.08,74.3 R17.2 R18.2 R19.2 R20.2 76.83,74.3 JP9.1
R1_C1
  Top 0.406: K3.4 45.72,17.14 45.72,8.26 47.31,6.67 51.44,6.67 52.07,6.03 62.39,6.03 X9.1
R1_C2
  Bottom 0.406: K3.13 56.52,19.05 JP4.1
R1_GND
  Bottom 0.61: X9.2 61.75,4.6 63.18,6.03 66.99,6.03 68.58,4.45 68.58,3.33 X10.2
R1_NC1
  Bottom 0.406: K3.6 49.53,15.88 57.15,15.88 JP1.1
R1_NC2
  Bottom 0.406: K3.11 55.24,13.34 56.52,12.06 JP3.1
R1_NO1
  Top 0.406: K3.8 52.7,8.89 54.29,7.3 64.77,7.3 66.04,6.03 70.17,6.03 72.07,4.13 72.07,3.34 X10.1
R1_NO2
  Bottom 0.406: K3.9 55.88,9.53 JP2.1
R2_C1
  Top 0.406: X24.1 75.41,6.99 67.94,6.99 64.14,10.79 64.14,16.51 K4.4
R2_C2
  Bottom 0.406: K4.13 70.48,19.05 JP8.1
R2_GND
  Bottom 0.61: X24.2 75.72,4.6 77.15,6.03 81.6,6.03 82.55,5.08 82.55,3.33 X25.2
R2_NC1
  Bottom 0.406: K4.6 63.5,15.88 71.12,15.88 JP5.1
R2_NC2
  Bottom 0.406: K4.11 69.22,13.34 70.48,12.06 JP7.1
R2_NO1
  Bottom 0.406: K4.8 63.5,6.99 84.77,6.99 86.04,6.03 86.04,3.33 X25.1
R2_NO2
  Bottom 0.406: K4.9 71.75,8.89 JP6.1
RUN1
  Bottom 0.406: IC3.18 10.79,55.24 9.84,54.29 9.84,52.7 10.79,51.44 13.34,51.44 16.51,48.26 16.51,22.23 18.41,20.32 20.95,20.32 22.23,19.05 22.23,17.14 23.5,15.88 R23.2
RUN2
  Bottom 0.406: IC3.17 13.34,52.7 17.14,48.9 17.14,28.57 18.41,27.3 20.32,27.3 21.59,26.04 21.59,23.5 22.86,22.23 R24.2
STATUS
  Bottom 0.406: IC3.16 12.7,50.16 15.88,46.99 15.88,15.88 17.78,13.97 20.95,13.97 22.23,12.7 22.23,10.79 23.5,9.53 R42.2
VCC
  Top 0.813: R35.2 R36.2 R37.2 R38.2 90.17,24.77 R39.2 R40.2 R45.2 R46.2 R50.2 R49.2 R48.2 90.17,54.61 | 11.43,45.09 IC3.14 8.89,45.09 7.62,46.35 7.62,55.88 8.26,57.15 | R51.2 R52.2 6.99,58.42 8.26,57.15 | 8.26,57.15 22.86,57.15 IC1.20 29.84,55.24 37.47,55.24 40.01,52.7 IC2.20 45.09,55.24 53.98,55.24 55.88,52.7 IC9.20 59.69,54.61 69.85,54.61 71.75,52.7 IC6.20 74.93,54.61 83.19,54.61 85.09,52.7 IC5.20 88.9,54.61 90.17,54.61 | 90.17,54.61 R47.2 90.17,64.77 | X19.1 44.61,75.25 71.75,75.25 | 71.75,75.25 73.82,75.25 X18.1 76.68,71.91 78.74,69.85 88.27,69.85 90.17,67.94 90.17,64.77 | K4.1 59.69,24.77 49.53,24.77 K3.1 29.84,26.67 28.57,25.4 28.57,24.13 R43.1 28.57,20.32 28.57,13.97 R44.1 26.04,7.62 23.5,7.62 R41.2 21.59,6.35 20.95,6.99 14.61,6.99 11.43,3.81 | IC4.16 10.16,29.84 8.26,27.94 8.26,6.99 11.43,3.81 | X17.1 11.43,3.81 | 71.75,75.25 JP10.1 | 90.17,64.77 JP11.1
  Bottom 0.813: IC4.16 13.34,29.84 14.29,30.48 14.29,44.13 13.34,45.09 IC3.14 12.7,45.09 | R38.2 R34.2 R33.2 R32.2 R31.2

### Text on the board
Top: Fishhead Industries | 2009 | v1.3
tValues: VCC | VCC | 1 | 2 | 3 | 4 | 5 | 6 | 7 | 8 | 1 | 2 | 3 | 4 | 5 | 6 | 7 | 8 | 5 | 6 | 7 | 8 | PULLUP3 | FBC3 | 8 | 7 | 6 | 5 | 4 | 3 | 2 | 1 | PWR | GND | ISOG2 | ISOI2 | ISOG2 | ISOO2 | ISOG1 | ISOI1 | ISOG1 | ISOO1 | R1C | R1IN | R1C | R1O | R2C | R2IN | R2C | R2O | BUS CONTROLLER | V1.3 | FHI (c) 2009